# EAGLE design MBED LAOS Circuit Board (EAGLE 5.11)
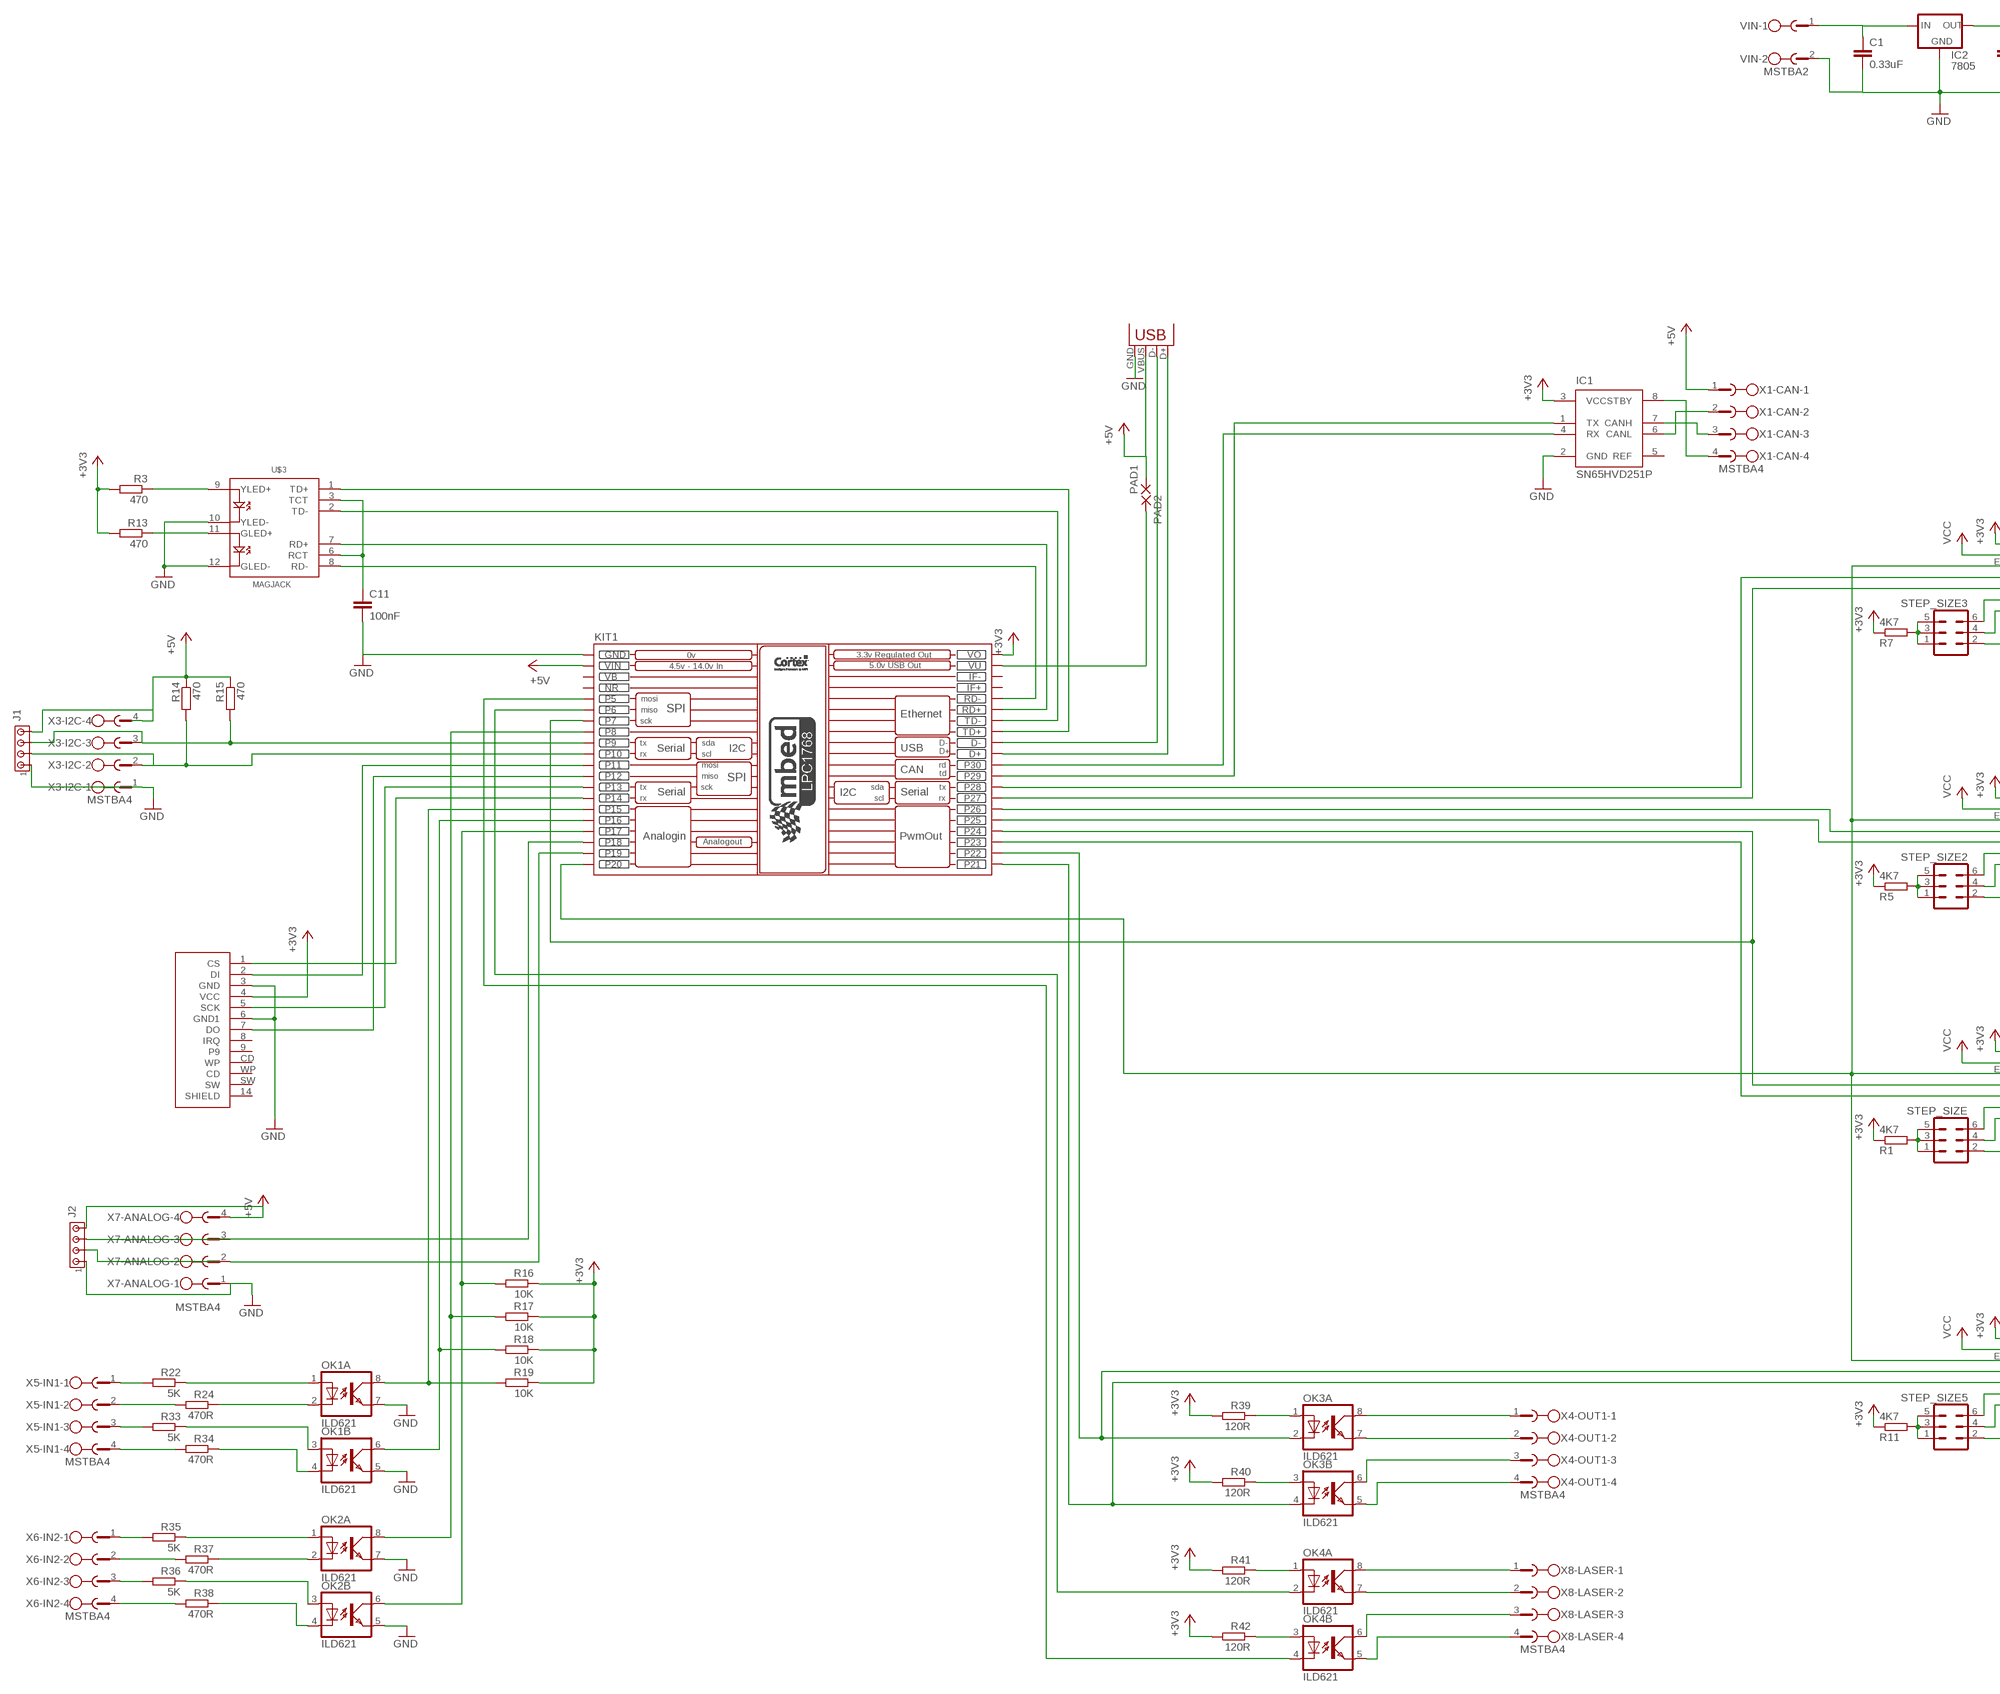
[diagram p0: schematic, sheet 1, part 1 of 2]
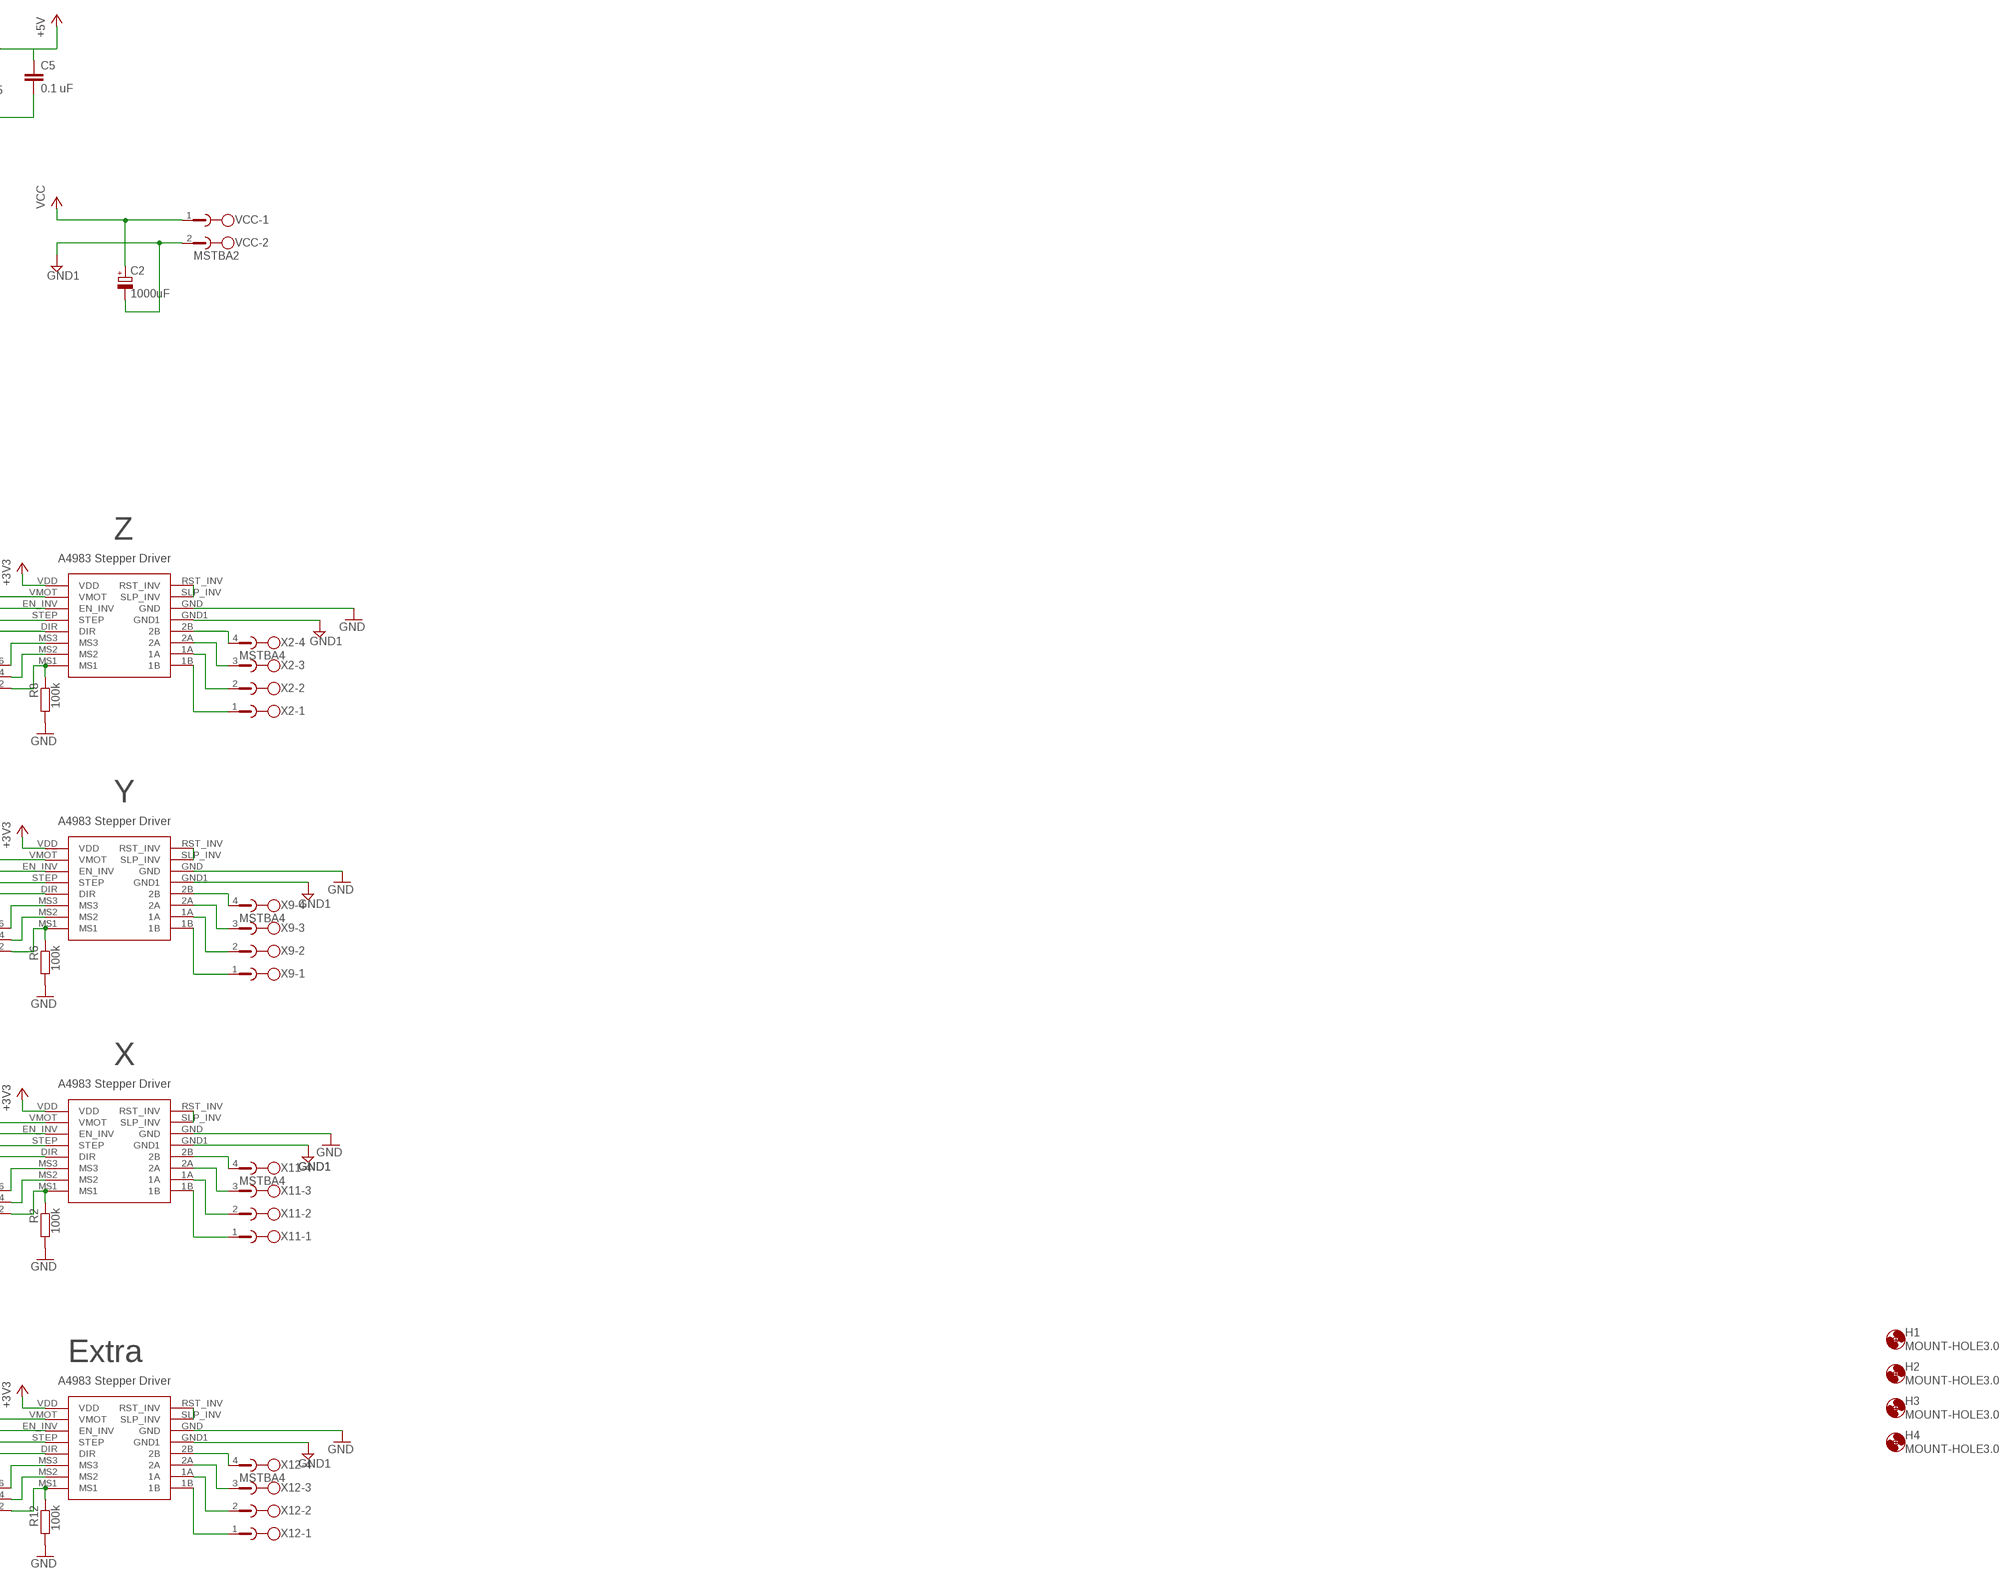
[diagram p1: schematic, sheet 1, part 2 of 2]

## Parts
C1  0.33uF  C-EU050-045X075  [C050-045X075]
C2  1000uF  CPOL-EUE7.5-16  [E7,5-16]
C5  0.1 uF  C-EU050-045X075  [C050-045X075]
C11  100nF  C-EU050-045X075  [C050-045X075]
EXTRA_STEPPER  A4983  [A4983]
H1  MOUNT-HOLE3.0  [3,0]
H2  MOUNT-HOLE3.0  [3,0]
H3  MOUNT-HOLE3.0  [3,0]
H4  MOUNT-HOLE3.0  [3,0]
IC1  SN65HVD251P  [DIL08]
IC2  7805  V_REG_78XXSIDE  [78XXL]
J1  MTA04-100  [10X04MTA]
J2  MTA04-100  [10X04MTA]
KIT1  MBED_NXP_LPC1768  [MBED-KIT]
OK1  ILD621  [DIL08]
OK2  ILD621  [DIL08]
OK3  ILD621  [DIL08]
OK4  ILD621  [DIL08]
PAD1  2,15/1,0  [2,15/1,0]
PAD2  2,15/1,0  [2,15/1,0]
R1  4K7  R-EU_0204/7  [0204/7]
R2  100k  R-EU_0204/7  [0204/7]
R3  470  R-EU_0204/7  [0204/7]
R5  4K7  R-EU_0204/7  [0204/7]
R6  100k  R-EU_0204/7  [0204/7]
R7  4K7  R-EU_0204/7  [0204/7]
R8  100k  R-EU_0204/7  [0204/7]
R11  4K7  R-EU_0204/7  [0204/7]
R12  100k  R-EU_0207/10  [0207/10]
R13  470  R-EU_0204/7  [0204/7]
R14  470  R-EU_0204/7  [0204/7]
R15  470  R-EU_0204/7  [0204/7]
R16  10K  R-EU_0204/7  [0204/7]
R17  10K  R-EU_0204/7  [0204/7]
R18  10K  R-EU_0204/7  [0204/7]
R19  10K  R-EU_0204/7  [0204/7]
R22  5K  R-EU_0204/7  [0204/7]
R24  470R  R-EU_0204/7  [0204/7]
R33  5K  R-EU_0204/7  [0204/7]
R34  470R  R-EU_0204/7  [0204/7]
R35  5K  R-EU_0204/7  [0204/7]
R36  5K  R-EU_0204/7  [0204/7]
R37  470R  R-EU_0204/7  [0204/7]
R38  470R  R-EU_0204/7  [0204/7]
R39  120R  R-EU_0204/7  [0204/7]
R40  120R  R-EU_0204/7  [0204/7]
R41  120R  R-EU_0204/7  [0204/7]
R42  120R  R-EU_0204/7  [0204/7]
STEP_SIZE  MA03-2  [MA03-2]
STEP_SIZE2  MA03-2  [MA03-2]
STEP_SIZE3  MA03-2  [MA03-2]
STEP_SIZE5  MA03-2  [MA03-2]
U$3  MAGJACK  [MAGJACK]
U$8  SD_CARD_SOCKETSD  [SD-MMC_SOCKET-PP]
VCC  MSTBA2  [MSTBA2]
VIN  MSTBA2  [MSTBA2]
X1-CAN  MSTBA4  [MSTBA4]
X2  MSTBA4  [MSTBA4]
X3-I2C  MSTBA4  [MSTBA4]
X4-OUT1  MSTBA4  [MSTBA4]
X5-IN1  MSTBA4  [MSTBA4]
X6-IN2  MSTBA4  [MSTBA4]
X7-ANALOG  MSTBA4  [MSTBA4]
X8-LASER  MSTBA4  [MSTBA4]
X9  MSTBA4  [MSTBA4]
X10  USB  [USB-MB-H-ASSMANN]
X11  MSTBA4  [MSTBA4]
X12  MSTBA4  [MSTBA4]
X_STEPPER  A4983  [A4983]
Y_STEPPER  A4983  [A4983]
Z_STEPPER  A4983  [A4983]

## Nets
+3V3: EXTRA_STEPPER.VDD IC1.3(VCC) KIT1.VOUT(VO) R1.1 R3.2 R5.1 R7.1 R11.1 R13.2 R16.1 R17.1 R18.1 R19.1 R39.2 R40.2 R41.2 R42.2 U$8.4(VCC) X_STEPPER.VDD Y_STEPPER.VDD Z_STEPPER.VDD
+5V: C5.1 IC2.OUT J1.4 J2.4 KIT1.VIN PAD1.1(P) R14.1 R15.1 X1-CAN.1 X3-I2C.4 X7-ANALOG.4 X10.VBUS
GND: C1.2 C5.2 C11.2 EXTRA_STEPPER.GND IC1.2(GND) IC2.GND J1.1 J2.1 KIT1.GND OK1.5(B:EMIT) OK1.7(A:EMIT) OK2.5(B:EMIT) OK2.7(A:EMIT) R2.2 R6.2 R8.2 R12.2 U$3.10(YLED-) U$3.12(GLED-) U$8.3(GND) U$8.6(GND1) VIN.2 X3-I2C.1 X7-ANALOG.1 X_STEPPER.GND Y_STEPPER.GND Z_STEPPER.GND
GND1: C2.- EXTRA_STEPPER.GND1 VCC.2 X_STEPPER.GND1 Y_STEPPER.GND1 Z_STEPPER.GND1
N$1: R2.1 STEP_SIZE.2 X_STEPPER.MS1
N$2: X_STEPPER.RST_INV X_STEPPER.SLP_INV
N$3: STEP_SIZE.4 X_STEPPER.MS2
N$4: R1.2 STEP_SIZE.1 STEP_SIZE.3 STEP_SIZE.5
N$5: STEP_SIZE.6 X_STEPPER.MS3
N$6: X11.4 X_STEPPER.2B
N$7: KIT1.P$23(P23) X_STEPPER.DIR
N$8: X11.3 X_STEPPER.2A
N$9: X11.2 X_STEPPER.1A
N$10: X11.1 X_STEPPER.1B
N$11: KIT1.P$7(P7) KIT1.P$24(P24) X_STEPPER.STEP
N$12: EXTRA_STEPPER.EN_INV KIT1.P$20(P20) X_STEPPER.EN_INV Y_STEPPER.EN_INV Z_STEPPER.EN_INV
N$13: KIT1.P$25(P25) Y_STEPPER.DIR
N$14: KIT1.P$26(P26) Y_STEPPER.STEP
N$15: KIT1.P$27(P27) Z_STEPPER.DIR
N$16: KIT1.P$28(P28) Z_STEPPER.STEP
N$17: IC1.1(TX) KIT1.P$29(P29)
N$18: IC1.4(RX) KIT1.P$30(P30)
N$19: R6.1 STEP_SIZE2.2 Y_STEPPER.MS1
N$20: R5.2 STEP_SIZE2.1 STEP_SIZE2.3 STEP_SIZE2.5
N$21: STEP_SIZE2.4 Y_STEPPER.MS2
N$22: STEP_SIZE2.6 Y_STEPPER.MS3
N$23: X9.3 Y_STEPPER.2A
N$24: X9.2 Y_STEPPER.1A
N$25: X9.1 Y_STEPPER.1B
N$26: IC1.8(STBY) X1-CAN.4
N$27: X9.4 Y_STEPPER.2B
N$28: Y_STEPPER.RST_INV Y_STEPPER.SLP_INV
N$29: R8.1 STEP_SIZE3.2 Z_STEPPER.MS1
N$30: R7.2 STEP_SIZE3.1 STEP_SIZE3.3 STEP_SIZE3.5
N$31: STEP_SIZE3.4 Z_STEPPER.MS2
N$32: STEP_SIZE3.6 Z_STEPPER.MS3
N$33: X2.3 Z_STEPPER.2A
N$34: X2.2 Z_STEPPER.1A
N$35: X2.1 Z_STEPPER.1B
N$36: X2.4 Z_STEPPER.2B
N$37: Z_STEPPER.RST_INV Z_STEPPER.SLP_INV
N$38: IC1.7(CANH) X1-CAN.3
N$39: IC1.6(CANL) X1-CAN.2
N$40: C1.1 IC2.IN VIN.1
N$41: KIT1.P$11(P11) U$8.2(DI)
N$43: KIT1.P$12(P12) U$8.7(DO)
N$44: KIT1.P$13(P13) U$8.5(SCK)
N$45: KIT1.P$14(P14) U$8.1(CS)
N$46: KIT1.D- X10.D-
N$47: EXTRA_STEPPER.MS1 R12.1 STEP_SIZE5.2
N$48: R11.2 STEP_SIZE5.1 STEP_SIZE5.3 STEP_SIZE5.5
N$49: EXTRA_STEPPER.MS2 STEP_SIZE5.4
N$50: EXTRA_STEPPER.MS3 STEP_SIZE5.6
N$51: EXTRA_STEPPER.2A X12.3
N$52: EXTRA_STEPPER.1A X12.2
N$53: EXTRA_STEPPER.1B X12.1
N$54: EXTRA_STEPPER.2B X12.4
N$55: EXTRA_STEPPER.RST_INV EXTRA_STEPPER.SLP_INV
N$56: KIT1.D+ X10.D+
N$58: J2.2
N$59: J2.3 KIT1.P$18(P18) X7-ANALOG.3
N$61: X10.GND
N$62: KIT1.VU PAD2.1(P)
N$69: R3.1 U$3.9(YLED+)
N$70: R13.1 U$3.11(GLED+)
N$71: KIT1.TD+ U$3.1(TD+)
N$81: KIT1.TD- U$3.2(TD-)
N$83: KIT1.RD+ U$3.7(RD+)
N$84: KIT1.RD- U$3.8(RD-)
N$85: C11.1 U$3.3(TCT) U$3.6(RCT)
N$86: KIT1.P$19(P19) X7-ANALOG.2
N$88: J1.2 KIT1.P$10(P10) R14.2 X3-I2C.2
N$92: J1.3 KIT1.P$9(P9) R15.2 X3-I2C.3
N$99: OK1.1(A:A) R22.1
N$101: OK1.2(A:C) R24.1
N$102: OK1.3(B:A) R33.1
N$103: OK1.4(B:C) R34.1
N$104: OK2.1(A:A) R35.1
N$105: OK2.2(A:C) R37.1
N$109: OK2.3(B:A) R36.1
N$110: OK2.4(B:C) R38.1
N$111: KIT1.P$15(P15) OK1.8(A:COL) R19.2
N$112: KIT1.P$16(P16) OK1.6(B:COL) R18.2
N$113: KIT1.P$8(P8) OK2.8(A:COL) R17.2
N$114: KIT1.P$17(P17) OK2.6(B:COL) R16.2
N$115: OK3.8(A:COL) X4-OUT1.1
N$116: OK3.7(A:EMIT) X4-OUT1.2
N$117: OK3.6(B:COL) X4-OUT1.3
N$118: OK3.5(B:EMIT) X4-OUT1.4
N$119: OK4.8(A:COL) X8-LASER.1
N$120: OK4.7(A:EMIT) X8-LASER.2
N$121: OK4.6(B:COL) X8-LASER.3
N$122: OK4.5(B:EMIT) X8-LASER.4
N$123: R22.2 X5-IN1.1
N$124: R24.2 X5-IN1.2
N$125: R33.2 X5-IN1.3
N$126: R34.2 X5-IN1.4
N$127: R35.2 X6-IN2.1
N$128: R36.2 X6-IN2.3
N$129: R37.2 X6-IN2.2
N$130: R38.2 X6-IN2.4
N$131: OK3.1(A:A) R39.1
N$132: OK3.3(B:A) R40.1
N$133: OK4.1(A:A) R41.1
N$134: OK4.3(B:A) R42.1
N$135: EXTRA_STEPPER.STEP KIT1.P$22(P22) OK3.2(A:C)
N$136: EXTRA_STEPPER.DIR KIT1.P$21(P21) OK3.4(B:C)
N$137: KIT1.P$6(P6) OK4.2(A:C)
N$138: KIT1.P$5(P5) OK4.4(B:C)
VCC: C2.+ EXTRA_STEPPER.VMOT VCC.1 X_STEPPER.VMOT Y_STEPPER.VMOT Z_STEPPER.VMOT
Unconnected: IC1.5(REF) KIT1.IF+ KIT1.IF- U$8.8(IRQ) U$8.9 U$8.14(SHIELD) U$8.CD(WP) U$8.SW U$8.WP(CD)

## Notes on the sheet
- Z
- Y
- X
- Extra

## Power pins joined to a net without a drawn wire
NR: KIT1.NR
VB: KIT1.VB

## Library data of the parts
C1 C5 = resistor:C-EU: CAPACITOR, European symbol
C2 = resistor:CPOL-EU: POLARIZED CAPACITOR, European symbol
C11 = rcl:C-EU: CAPACITOR, European symbol
EXTRA_STEPPER X_STEPPER Y_STEPPER Z_STEPPER = A4983(JJ):A4983
H1-H4 = holes:MOUNT-HOLE: MOUNTING HOLE with drill center marker
IC1 = ti-can:SN65HVD251
IC2 = SparkFun:V_REG_78XX: Voltage Regulator Standard 7805 5V regulator. IGO (Input Ground Output). Spark Fun Electronics SKU : COM-00107
J1 J2 = con-amp:MTA04-100: AMP connector; OC_FARNELL: unknown; OC_NEWARK: unknown
KIT1 = MBED_v2.1:MBED_NXP_LPC1768: Mbed LPC1768 - ARM CORTEX v2.1 * Schematic symbol is now placed in eagles's default raster. *The pads diameter are suitable for routing between mbed pins * mbed pads are 0.8 mm drill diameter. --------------------------------------------- Created by: Mohamed Yousry *Alexandria, Egypt *Email: mohamed.yousry@ieeegoldegypt.org
OK1-OK4 = optocoupler:ILD621: SIEMENS OPTO COUPLER; MF: VISHAY/TELEFUNKEN; MPN: ILD621; OC_FARNELL: 1020151; OC_NEWARK: 58K1678
PAD1 PAD2 = wirepad:2,15/1,0: THROUGH-HOLE PAD
R1 R3 R5-R7 R11-R19 R22 R24 R33-R42 = rcl:R-EU_: RESISTOR, European symbol
R2 R8 = resistor:R-EU_: RESISTOR, European symbol
STEP_SIZE STEP_SIZE2 STEP_SIZE3 STEP_SIZE5 = con-lstb:MA03-2: PIN HEADER; OC_FARNELL: unknown; OC_NEWARK: unknown
U$3 = SparkFun:MAGJACK
U$8 = SparkFun:SD_CARD_SOCKET: SD/MMC Socket Media socket for SD and MMC cards. Push-push type. Schematic element and footprint production proven. Spark Fun Electronics SKU : PRT-00136
VCC VIN = con-phoenix-508:MSTBA2: PHOENIX; MF: FARNELL; MPN: 1757242; OC_FARNELL: 3705171; OC_NEWARK: 71C4161
X1-CAN X2 X3-I2C X4-OUT1 X5-IN1 X6-IN2 X7-ANALOG X8-LASER X9 X11 X12 = con-phoenix-508:MSTBA4: PHOENIX; MF: FARNELL; MPN: 1757268; OC_FARNELL: 3705195; OC_NEWARK: 71C4163
X10 = SparkFun:USB: USB Connectors USB-B-PTH is fully proven SKU : PRT-00139 USB-miniB is fully proven SKU : PRT-00587 USB-A-PCB is untested. USB-A-H is throughly reviewed, but untested. Spark Fun Electronics SKU : PRT-00437 USB-B-SMT is throughly reviewed, but untested. Needs silkscreen touching up. USB-A-S has not been used/tested USB-MB-H has not been used/tested

## Net classes
0 default: width 0.254 mm, clearance 0.305 mm
1 signal: width 0.203 mm, clearance 0.406 mm
2 gnd: width 0.203 mm, drill 0.711 mm, clearance 0.305 mm
3 usbvcc: width 0.508 mm, drill 0.711 mm, clearance 0.305 mm

## Board
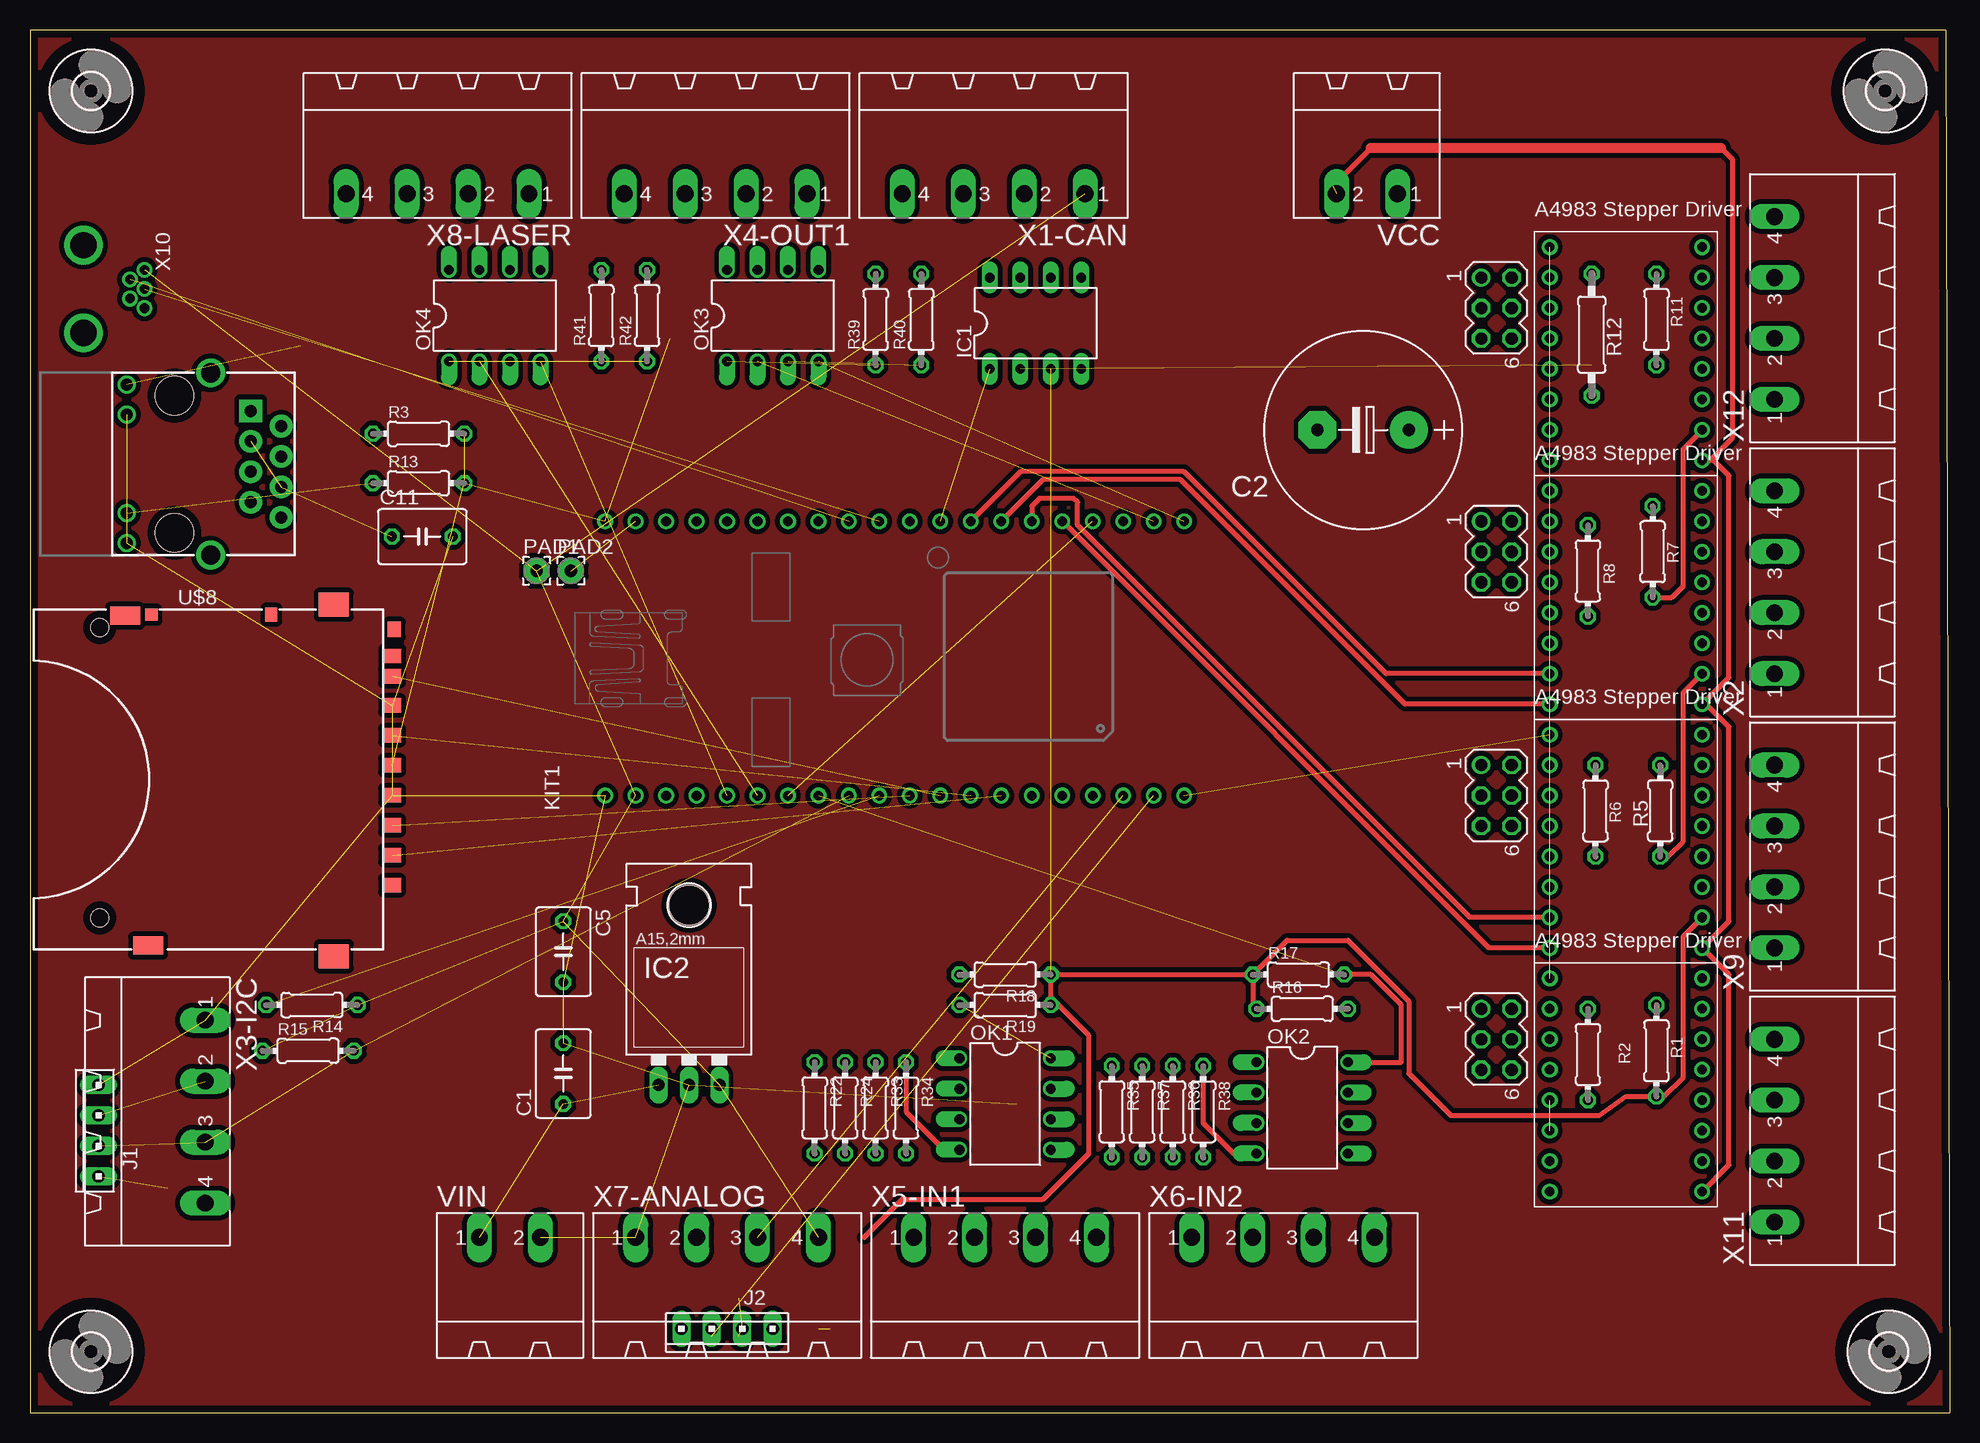
[diagram p2: board, top side]
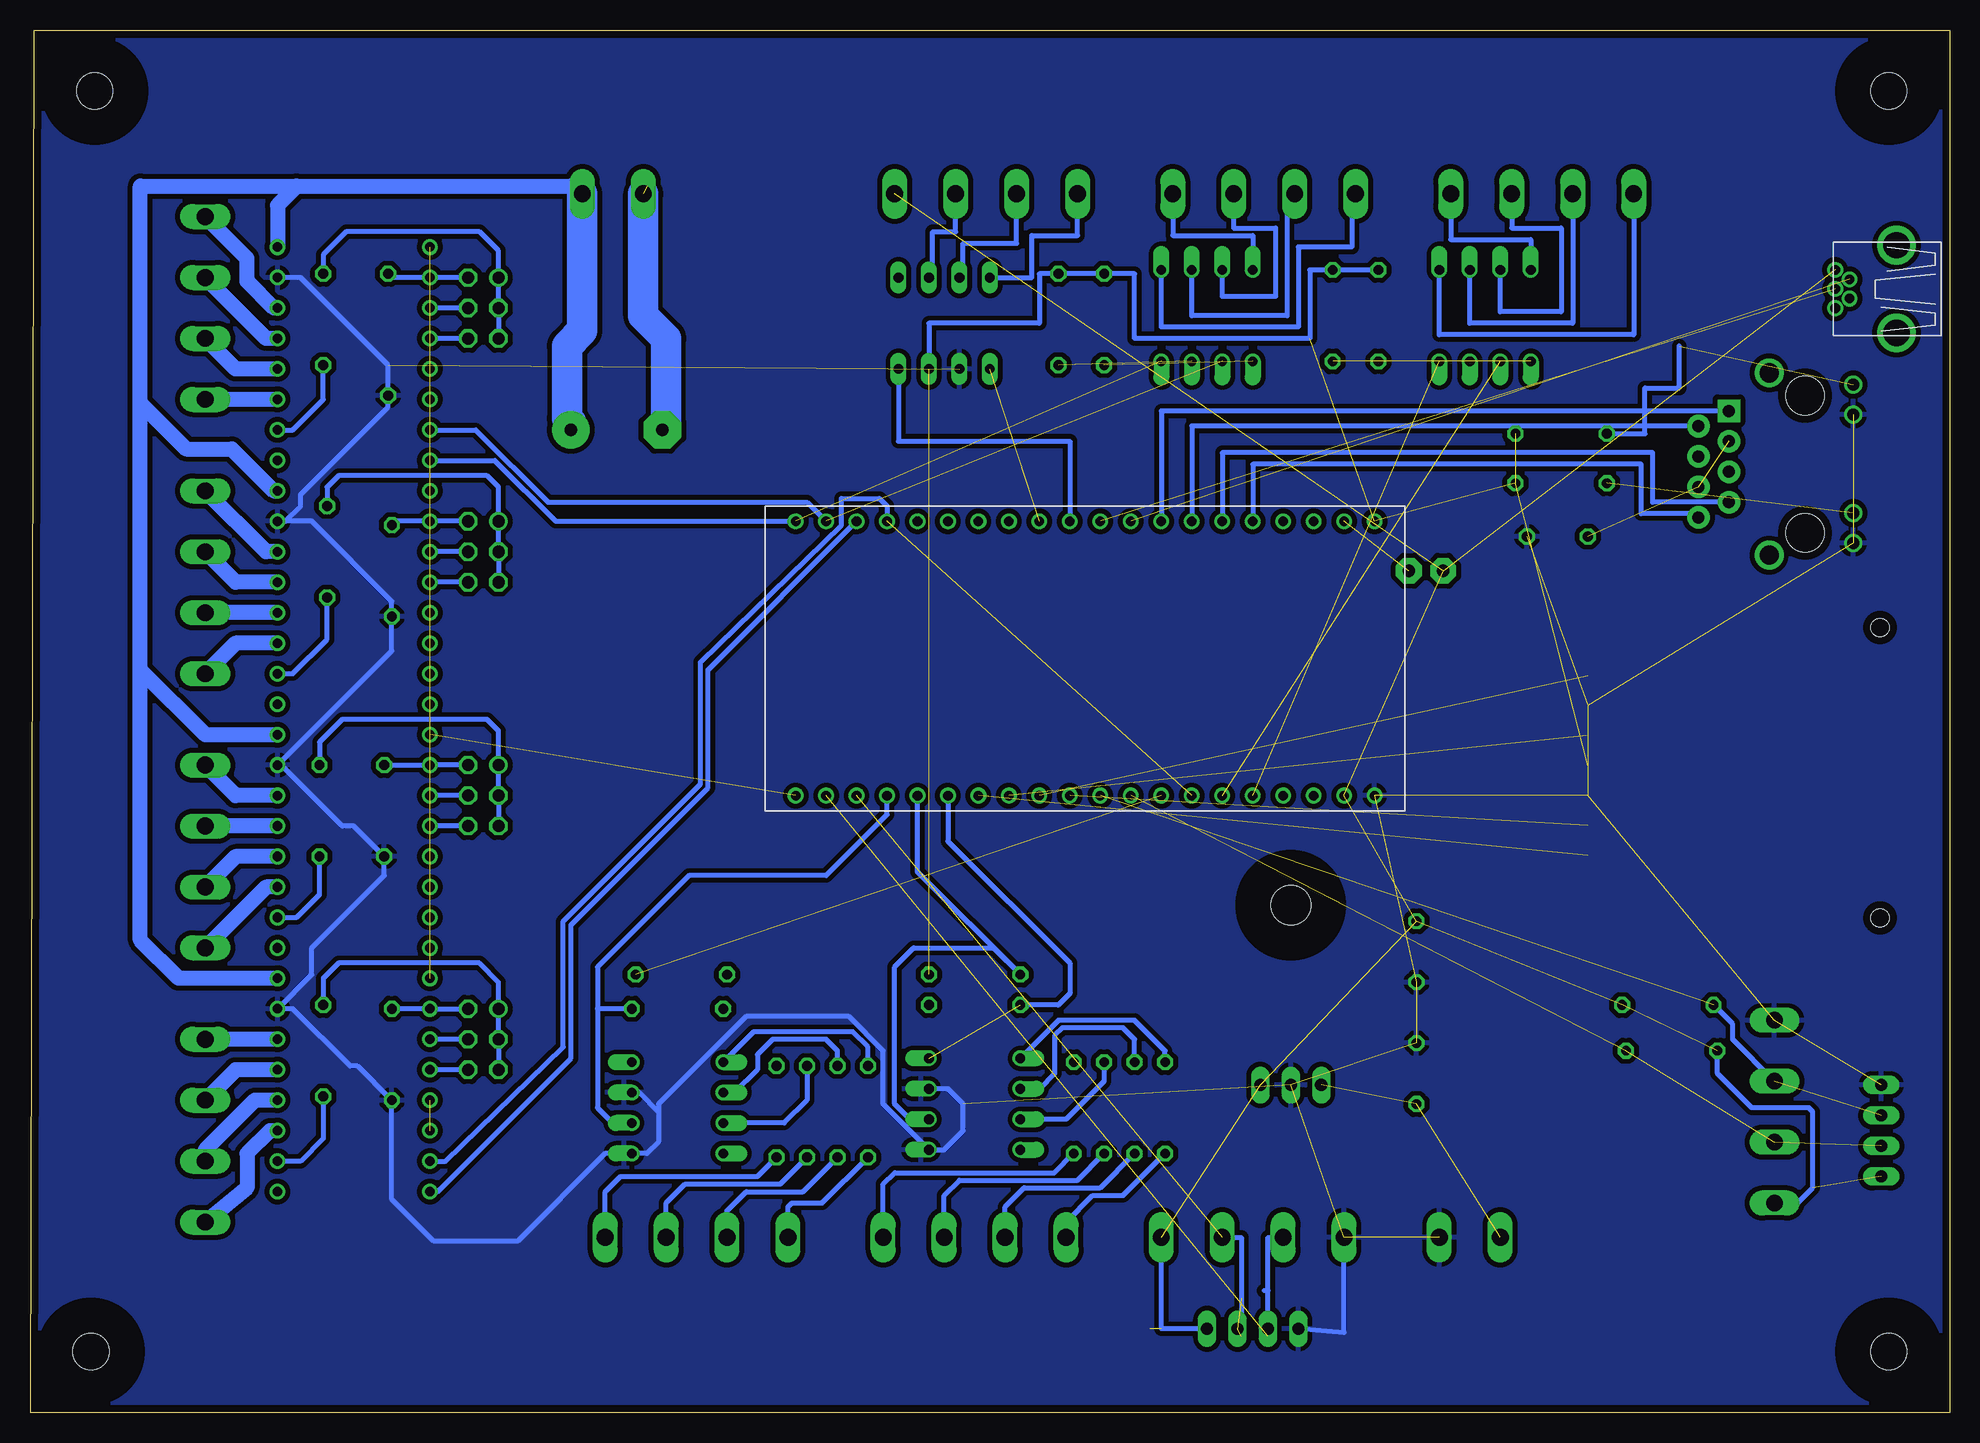
[diagram p3: board, bottom side, seen from below]

Size 160.02 x 115.25 mm. Coordinates in mm from the lower left corner, seen from the top.
Outline: 0,115.24 0,0 160.02,0 159.7,115.25 0,115.25
Copper layers (1*16): Top 0.035mm / dielectric 1.5mm / Bottom 0.035mm
Design rules "default *": minimum track width 8mil, minimum drill 20mil, track to track 0.2mm, track to pad 0.2mm, pad to pad 0.2mm, via to via 0.2mm, smd to smd 8mil, copper to edge 25mil, drill to drill 12mil, minimum pad ring 10mil, minimum via ring 8mil, stop-mask expansion 4mil, vias tented up to drill 0mil, thermal gap 15mil

### Footprints (pad centres in the part's own frame; a part is rotated, then mirrored left to right if it is on the bottom)
C050-045X075 = drill 0.813 octagon: 1 -2.54,0; 2 2.54,0
E7,5-16 = drill 1.016 pad 3.15 round: + -3.81,0 | drill 1.016 pad 3.15 octagon: - 3.81,0
A4983 = drill 0.8 round: 1A 6.35,-1.27; 1B 6.35,-3.81; 2A 6.35,1.27; 2B 6.35,3.81; DIR -6.35,-8.89; EN_INV -6.35,8.89; GND 6.35,6.35; GND1 6.35,-8.89; MS1 -6.35,6.35; MS2 -6.35,3.81; MS3 -6.35,1.27; RST_INV -6.35,-1.27; SLP_INV -6.35,-3.81; STEP -6.35,-6.35; VDD 6.35,-6.35; VMOT 6.35,8.89
3,0 = hole 3: 0,0
DIL08 = drill 0.813 long: 1 -3.81,-3.81; 2 -1.27,-3.81; 3 1.27,-3.81; 4 3.81,-3.81; 5 3.81,3.81; 6 1.27,3.81; 7 -1.27,3.81; 8 -3.81,3.81
78XXL = drill 1.016 long: GND 0,-3.81; IN -2.54,-3.81; OUT 2.54,-3.81 | hole 3.302: 0,11.176
10X04MTA = drill 1.016 long: 1 3.81,0; 2 1.27,0; 3 -1.27,0; 4 -3.81,0
MBED-KIT = drill 0.8 round: D+ 11.43,1.27; D- 11.43,3.81; GND -11.43,24.13; IF+ 11.43,16.51; IF- 11.43,19.05; NR -11.43,16.51; P$5 -11.43,13.97; P$6 -11.43,11.43; P$7 -11.43,8.89; P$8 -11.43,6.35; P$9 -11.43,3.81; P$10 -11.43,1.27; P$11 -11.43,-1.27; P$12 -11.43,-3.81; P$13 -11.43,-6.35; P$14 -11.43,-8.89; P$15 -11.43,-11.43; P$16 -11.43,-13.97; P$17 -11.43,-16.51; P$18 -11.43,-19.05; P$19 -11.43,-21.59; P$20 -11.43,-24.13; P$21 11.43,-24.13; P$22 11.43,-21.59; P$23 11.43,-19.05; P$24 11.43,-16.51; P$25 11.43,-13.97; P$26 11.43,-11.43; P$27 11.43,-8.89; P$28 11.43,-6.35; P$29 11.43,-3.81; P$30 11.43,-1.27; RD+ 11.43,11.43; RD- 11.43,13.97; TD+ 11.43,6.35; TD- 11.43,8.89; VB -11.43,19.05; VIN -11.43,21.59; VOUT 11.43,24.13; VU 11.43,21.59
DIL08' = drill 0.813 offset: 1 -3.81,-3.81; 2 -1.27,-3.81; 3 1.27,-3.81; 4 3.81,-3.81; 5 3.81,3.81; 6 1.27,3.81; 7 -1.27,3.81; 8 -3.81,3.81
2,15/1,0 = drill 1.016 pad 2.159 octagon: 1 0,0
0204/7 = drill 0.813 octagon: 1 -3.81,0; 2 3.81,0
0207/10 = drill 0.813 octagon: 1 -5.08,0; 2 5.08,0
MA03-2 = drill 1.016 round: 1 -2.54,-1.27 | drill 1.016 octagon: 2 -2.54,1.27; 3 0,-1.27; 4 0,1.27; 5 2.54,-1.27; 6 2.54,1.27
MAGJACK = drill 1 pad 1.88 square: 1 3.175,17.445 | drill 1 pad 1.88 round: 2 4.445,19.985; 3 5.715,17.445; 4 6.985,19.985; 5 8.255,17.445; 6 9.525,19.985; 7 10.795,17.445; 8 12.065,19.985 | drill 1 pad 1.27 round: 9 1,7.1; 10 3.5,7.1; 11 11.7,7.1; 12 14.2,7.1 | drill 1.6 pad 2.184 round: M1 0,14.1; M2 15.2,14.1 | hole 3.2: 1.905,11.095; 13.335,11.095
SD-MMC_SOCKET-PP = smd 1.2 x 1.5: 1 6.88,29.85; 2 4.38,29.85; 3 1.88,29.85; 4 -0.62,29.85; 5 -3.12,29.85; 6 -5.62,29.85; 7 -8.04,29.85; 8 -9.728,29.87; 9 9.38,29.85 | smd 1.5 x 2.5: 12 -13.1,7.6; 13 14.402,9.525 | smd 2 x 2.5: 14 -14,25; 15 15.3,25 | smd 1.15 x 1: CD -13.18,19.8 | smd 1.3 x 1.1: SW -11.938,30.048 | smd 1 x 1.05: WP -13.18,9.8 | hole 1.5: -12.1,5.5; 12.1,5.5
MSTBA2 = drill 1.397 long: 1 -2.54,5.08; 2 2.54,5.08
MSTBA4 = drill 1.397 long: 1 -7.62,5.08; 2 -2.54,5.08; 3 2.54,5.08; 4 7.62,5.08
USB-MB-H-ASSMANN = drill 0.8 round: D+ 5.1,0; D- 3.9,0.8; GND 5.1,-1.6; ID 3.9,-0.8; VBUS 5.1,1.6 | drill 2.2 round: P$6 0,-3.65; P$7 0,3.65

### Placement (x,y rotation side)
C1  44.45,28.26 90 top
C2  111.12,81.92 180 top
C5  44.45,38.42 270 top
C11  32.7,73.03 0 top
EXTRA_STEPPER  133.03,88.27 0 top
H1  5.08,5.08 0 top
H2  154.94,5.08 0 top
H3  154.62,110.17 0 top
H4  5.08,110.17 0 top
IC1  83.82,90.81 0 top
IC2  54.93,31.11 0 top
J1  5.71,23.5 90 top
J2  58.1,6.99 180 top
KIT1  72.07,62.87 90 top
OK1  ILD621  [DIL08']  81.28,25.72 270 top
OK2  ILD621  [DIL08']  106.05,25.4 270 top
OK3  ILD621  [DIL08']  61.91,91.44 0 top
OK4  ILD621  [DIL08']  38.73,91.44 0 top
PAD1  42.23,70.17 0 top
PAD2  45.09,70.17 0 top
R1  135.57,30.16 90 top
R2  129.86,29.84 270 top
R3  32.38,81.6 0 top
R5  135.89,50.16 90 top
R6  130.49,50.16 270 top
R7  135.25,71.75 90 top
R8  129.86,70.17 270 top
R11  135.57,91.12 90 top
R12  130.18,89.85 270 top
R13  32.38,77.47 0 top
R14  23.5,33.97 180 top
R15  23.18,30.16 0 top
R16  106.05,33.66 0 top
R17  105.73,36.51 0 top
R18  81.28,36.51 180 top
R19  81.28,33.97 180 top
R22  65.41,25.4 270 top
R24  67.94,25.4 270 top
R33  70.48,25.4 270 top
R34  73.03,25.4 270 top
R35  90.17,25.08 270 top
R36  95.25,25.08 270 top
R37  92.71,25.08 270 top
R38  97.79,25.08 270 top
R39  70.48,91.12 90 top
R40  74.3,91.12 90 top
R41  47.62,91.44 90 top
R42  51.44,91.44 90 top
STEP_SIZE  122.24,31.11 270 top
STEP_SIZE2  122.24,51.44 270 top
STEP_SIZE3  122.24,71.75 270 top
STEP_SIZE5  122.24,92.08 270 top
U$3  0.95,86.68 270 top
U$8  0.32,53.34 270 top
VCC  111.44,106.68 180 top
VIN  40.01,9.53 0 top
X1-CAN  80.33,106.68 180 top
X2  150.5,69.22 90 top
X3-I2C  9.53,25.08 270 top
X4-OUT1  57.15,106.68 180 top
X5-IN1  81.28,9.53 0 top
X6-IN2  104.46,9.53 0 top
X7-ANALOG  58.1,9.53 0 top
X8-LASER  33.97,106.68 180 top
X9  150.5,46.35 90 top
X10  4.45,93.66 0 top
X11  150.5,23.5 90 top
X12  150.5,92.08 90 top
X_STEPPER  133.03,27.3 0 top
Y_STEPPER  133.03,47.62 0 top
Z_STEPPER  133.03,67.94 0 top

### Tracks (layer width: path | path; a pad name or v marks a point on that pad's centre or on a via)
+3V3  (5 unrouted)
  Top 0.406: R17.1 R18.1 85.09,34.61 | 85.09,34.61 R19.1 | R17.1 101.92,33.97 R16.1 | Y_STEPPER.VDD 137.79,39.69 137.79,27.94 136.21,26.35 R1.1 133.03,26.35 130.81,24.77 118.43,24.77 114.94,28.26 114.94,34.29 109.86,39.37 104.78,39.37 R17.1 | R5.1 136.53,46.35 137.79,47.62 137.79,60.01 Z_STEPPER.VDD | R7.1 136.84,67.94 137.79,68.9 137.79,80.33 EXTRA_STEPPER.VDD | 69.53,14.61 72.71,17.78 84.45,17.78 88.27,21.59 88.27,31.43 85.09,34.61
  Bottom 0.406: IC1.3 85.09,90.81 75.88,90.81 75.88,94.93 R40.2 R39.2 67.94,94.93 67.94,89.53 53.34,89.53 53.34,95.25 R42.2 R41.2 | EXTRA_STEPPER.VDD 138.11,81.92 135.57,84.45 R11.1 | R7.1 135.25,64.45 138.11,61.59 Z_STEPPER.VDD | R5.1 135.89,43.18 137.79,41.27 Y_STEPPER.VDD | R1.1 135.57,22.86 137.48,20.95 X_STEPPER.VDD
+5V  (10 unrouted)
  Bottom 0.406: R15.1 19.37,28.26 16.51,25.4 11.75,25.4 11.43,25.08 11.43,18.73 13.02,17.14 14.29,17.14 X3-I2C.4 | J2.4 65.72,6.99 X7-ANALOG.4
GND  (14 unrouted)
  Bottom 0.406: 107.63,25.08 107.63,22.54 108.58,21.59 OK2.5 112.08,21.59 119.38,14.29 126.36,14.29 129.86,17.78 R2.2 132.72,28.89 133.35,28.89 138.11,33.66 X_STEPPER.GND 136.53,36.51 136.53,38.73 130.49,44.77 R6.2 133.03,48.9 133.99,48.9 139.06,53.98 Y_STEPPER.GND 129.86,63.5 R8.2 129.86,67.63 136.53,74.3 138.75,74.3 | 107.63,25.08 109.22,26.67 OK2.7 | OK1.7 83.5,26.99 82.23,25.72 82.23,23.5 83.82,21.91 OK1.5 88.9,25.72 88.9,30.16 91.76,33.02 100.33,33.02 107.63,25.72 107.63,25.08 | EXTRA_STEPPER.GND 137.48,94.61 130.18,87.31 R12.2 130.18,83.82 137.48,76.52 137.48,75.56 138.75,74.3 | 138.75,74.3 Z_STEPPER.GND | X7-ANALOG.1 50.48,6.67 J2.1
  pour Bottom (isolate 0.406): 0,115.25 159.7,115.25 160.02,0 0,0
GND1  (1 unrouted)
  Top 0.406: X_STEPPER.GND1 141.6,20.64 141.6,36.51 Y_STEPPER.GND1 141.6,40.96 141.6,57.15 139.7,59.05 Z_STEPPER.GND1 141.6,61.28 141.6,78.11 140.34,79.38 EXTRA_STEPPER.GND1 140.02,79.38 141.92,81.28 141.92,104.46 140.97,105.41 | 111.76,105.41 108.58,102.23
  Top 0.813: 140.97,105.41 111.76,105.41
  Bottom 2.54: VCC.2 108.9,91.44 107,89.53 107,82.23 C2.-
N$1
  Bottom 0.406: R2.1 X_STEPPER.MS1 STEP_SIZE.2
N$2  (1 unrouted)
N$3
  Bottom 0.406: STEP_SIZE.4 X_STEPPER.MS2
N$4
  Bottom 0.406: R1.2 135.57,36.2 134.3,37.47 122.56,37.47 120.97,35.88 STEP_SIZE.1 STEP_SIZE.3 STEP_SIZE.5
N$5
  Bottom 0.406: STEP_SIZE.6 X_STEPPER.MS3
N$6
  Bottom 1.27: X_STEPPER.2B X11.4
N$7
  Bottom 0.406: X_STEPPER.DIR 126.05,18.41 114.94,29.53 114.94,40.64 103.5,52.07 103.5,61.91 KIT1.P$23
N$8
  Bottom 1.27: X_STEPPER.2A 142.88,28.57 X11.3
N$9
  Bottom 1.27: X_STEPPER.1A 141.29,26.04 145.41,21.91 X11.2
N$10
  Bottom 1.27: X_STEPPER.1B 140.02,23.5 141.92,21.59 141.92,18.73 X11.1
N$11  (1 unrouted)
  Bottom 0.406: X_STEPPER.STEP 125.41,20.95 115.57,30.48 115.57,40.96 104.14,52.39 104.14,62.55 92.39,73.98 92.39,76.2 89.22,76.2 88.58,75.56 KIT1.P$24
N$12  (4 unrouted)
N$13
  Top 0.406: Y_STEPPER.DIR 121.6,38.73 KIT1.P$25
N$14
  Top 0.406: Y_STEPPER.STEP 120.02,41.27 87.31,73.98 87.31,75.88 87,76.2 84.14,76.2 83.5,75.56 KIT1.P$26
N$15
  Top 0.406: Z_STEPPER.DIR 114.62,59.05 95.89,77.79 84.45,77.79 KIT1.P$27
N$16
  Top 0.406: Z_STEPPER.STEP 113.03,61.59 96.2,78.42 82.55,78.42 KIT1.P$28
N$17  (1 unrouted)
N$18
  Bottom 0.406: IC1.4 87.63,80.96 73.34,80.96 KIT1.P$30
N$19
  Bottom 0.406: STEP_SIZE2.2 Y_STEPPER.MS1 R6.1
N$20
  Bottom 0.406: R5.2 135.89,55.88 133.99,57.78 121.92,57.78 120.97,56.83 STEP_SIZE2.1 STEP_SIZE2.3 STEP_SIZE2.5
N$21
  Bottom 0.406: STEP_SIZE2.4 Y_STEPPER.MS2
N$22
  Bottom 0.406: STEP_SIZE2.6 Y_STEPPER.MS3
N$23
  Bottom 1.27: Y_STEPPER.2A X9.3
N$24
  Bottom 1.27: Y_STEPPER.1A 142.88,46.35 X9.2
N$25
  Bottom 1.27: Y_STEPPER.1B 140.34,43.81 X9.1
N$26
  Bottom 0.406: IC1.8 76.52,94.61 76.52,98.11 72.71,98.11 X1-CAN.4
N$27
  Bottom 1.27: Y_STEPPER.2B 142.88,51.44 X9.4
N$28  (1 unrouted)
N$29
  Bottom 0.406: STEP_SIZE3.2 Z_STEPPER.MS1 129.54,74.3 R8.1
N$30
  Bottom 0.406: R7.2 135.25,77.15 134.3,78.11 121.92,78.11 120.97,77.15 STEP_SIZE3.1 STEP_SIZE3.3 STEP_SIZE3.5
N$31
  Bottom 0.406: STEP_SIZE3.4 Z_STEPPER.MS2
N$32
  Bottom 0.406: STEP_SIZE3.6 Z_STEPPER.MS3
N$33
  Bottom 1.27: Z_STEPPER.2A 142.88,69.22 X2.3
N$34
  Bottom 1.27: Z_STEPPER.1A X2.2
N$35
  Bottom 1.27: Z_STEPPER.1B 142.88,64.14 X2.1
N$36
  Bottom 1.27: Z_STEPPER.2B 140.34,71.75 X2.4
N$37  (1 unrouted)
N$38
  Bottom 0.406: IC1.7 82.23,94.61 82.23,97.47 77.79,97.47 X1-CAN.3
N$39
  Bottom 0.406: IC1.6 84.77,94.61 84.77,98.42 82.87,98.42 X1-CAN.2
N$40  (2 unrouted)
N$41  (1 unrouted)
N$43  (1 unrouted)
N$44  (1 unrouted)
N$45  (1 unrouted)
N$46  (1 unrouted)
N$47
  Bottom 0.406: STEP_SIZE5.2 EXTRA_STEPPER.MS1 129.86,94.61 R12.1
N$48
  Bottom 0.406: R11.2 135.57,96.52 133.67,98.42 122.56,98.42 120.97,96.84 STEP_SIZE5.1 STEP_SIZE5.3 STEP_SIZE5.5
N$49
  Bottom 0.406: STEP_SIZE5.4 EXTRA_STEPPER.MS2
N$50
  Bottom 0.406: STEP_SIZE5.6 EXTRA_STEPPER.MS3
N$51
  Bottom 1.27: EXTRA_STEPPER.2A 140.34,89.53 X12.3
N$52
  Bottom 1.27: EXTRA_STEPPER.1A 142.88,87 X12.2
N$53
  Bottom 1.27: EXTRA_STEPPER.1B X12.1
N$54
  Bottom 1.27: EXTRA_STEPPER.2B 139.7,92.08 141.92,94.3 141.92,96.2 X12.4
N$55  (1 unrouted)
N$56  (1 unrouted)
N$59  (3 unrouted)
  Bottom 0.406: X7-ANALOG.3 59.05,14.61 59.05,6.35
N$62  (1 unrouted)
N$69  (1 unrouted)
  Bottom 0.406: R3.1 25.4,81.6 25.4,85.41 22.54,85.41 22.54,88.9
N$70  (1 unrouted)
N$71
  Bottom 0.406: U$3.1 65.72,83.5 KIT1.TD+
N$81
  Bottom 0.406: U$3.2 63.18,82.23 KIT1.TD-
N$83
  Bottom 0.406: U$3.7 24.77,75.88 24.77,80.01 60.64,80.01 KIT1.RD+
N$84
  Bottom 0.406: U$3.8 21.27,74.61 21.27,74.93 25.72,74.93 25.72,79.06 58.1,79.06 KIT1.RD-
N$85  (2 unrouted)
N$86  (1 unrouted)
  Bottom 0.406: X7-ANALOG.2 56.83,14.61 56.83,10.16 | 56.83,10.16 57.15,10.16 | 56.83,6.35 56.83,10.16
N$88  (2 unrouted)
  Bottom 0.406: R14.2 18.1,32.38 18.1,31.11 X3-I2C.2
N$92  (3 unrouted)
N$99
  Bottom 0.406: R22.1 65.41,30.16 67.94,32.7 74.3,32.7 OK1.1
N$101
  Bottom 0.406: R24.1 67.94,31.11 68.9,32.07 73.98,32.07 74.61,31.43 74.61,28.26 75.88,26.99 OK1.2
N$102
  Bottom 0.406: R33.1 70.48,27.62 73.66,24.45 OK1.3
N$103
  Top 0.406: R34.1 73.03,25.08 76.2,21.91 OK1.4
N$104
  Bottom 0.406: R35.1 90.17,30.48 91.44,31.75 99.69,31.75 OK2.1
N$105
  Bottom 0.406: R37.1 92.71,30.16 93.66,31.11 98.11,31.11 99.38,29.84 99.38,28.57 101.28,26.67 OK2.2
N$109
  Bottom 0.406: R36.1 95.25,26.04 97.16,24.13 OK2.3
N$110
  Top 0.406: R38.1 97.79,24.13 100.33,21.59 OK2.4
N$111  (1 unrouted)
  Bottom 0.406: KIT1.P$15 83.5,47.62 73.34,37.47 73.34,34.92 74.3,33.97 R19.2
N$112
  Bottom 0.406: KIT1.P$16 86.04,45.09 R18.2 79.69,38.73 86.36,38.73 87.95,37.15 87.95,25.72 86.68,24.45 OK1.6
N$113  (1 unrouted)
  Top 0.406: R17.2 111.76,36.51 114.3,33.97 114.3,29.21 OK2.8
N$114
  Bottom 0.406: KIT1.P$17 88.58,49.85 93.66,44.77 105.09,44.77 112.71,37.15 112.71,33.66 | R16.2 112.71,33.66 | 112.71,33.66 112.71,25.4 111.44,24.13 OK2.6
N$115
  Bottom 0.406: X4-OUT1.1 64.77,98.11 58.1,98.11 OK3.8
N$116
  Bottom 0.406: X4-OUT1.2 59.69,98.74 56.2,98.74 56.2,93.03 60.64,93.03 OK3.7
N$117
  Bottom 0.406: X4-OUT1.3 55.24,101.6 55.24,91.44 63.18,91.44 OK3.6
N$118
  Bottom 0.406: X4-OUT1.4 49.85,101.6 49.85,97.16 54.29,97.16 54.29,90.49 65.72,90.49 OK3.5
N$119
  Bottom 0.406: X8-LASER.1 41.59,97.79 34.92,97.79 OK4.8
N$120
  Bottom 0.406: X8-LASER.2 36.51,98.74 32.38,98.74 32.38,91.76 37.47,91.76 OK4.7
N$121
  Bottom 0.406: X8-LASER.3 31.43,90.81 40.01,90.81 OK4.6
N$122
  Bottom 0.406: X8-LASER.4 26.35,89.85 42.55,89.85 OK4.5
N$123
  Bottom 0.406: X5-IN1.1 73.66,15.88 71.44,18.1 68.9,18.1 R22.2
N$124
  Bottom 0.406: X5-IN1.2 78.74,17.14 77.15,18.73 70.8,18.73 R24.2
N$125
  Bottom 0.406: X5-IN1.3 83.82,18.1 82.55,19.37 72.71,19.37 R33.2
N$126
  Bottom 0.406: X5-IN1.4 88.9,19.05 87.95,20 74.61,20 R34.2
N$127
  Bottom 0.406: X6-IN2.1 96.84,17.14 96.52,17.46 93.98,17.46 R35.2
N$128
  Bottom 0.406: X6-IN2.3 107,17.46 105.41,19.05 97.47,19.05 R36.2
N$129
  Bottom 0.406: X6-IN2.2 101.92,16.83 100.33,18.41 95.57,18.41 R37.2
N$130
  Bottom 0.406: X6-IN2.4 112.08,18.41 110.81,19.68 99.38,19.68 R38.2
N$131  (1 unrouted)
N$132  (1 unrouted)
N$133  (1 unrouted)
N$134  (1 unrouted)
N$135  (1 unrouted)
  Bottom 0.406: EXTRA_STEPPER.STEP 122.87,81.92 116.84,75.88 95.25,75.88 KIT1.P$22
N$136  (1 unrouted)
  Bottom 0.406: EXTRA_STEPPER.DIR 121.28,79.38 116.2,74.3 KIT1.P$21
N$137  (1 unrouted)
N$138  (1 unrouted)
VCC
  Bottom 1.27: EXTRA_STEPPER.VMOT 139.38,100.65 137.79,102.23 | Z_STEPPER.VMOT 139.7,76.83 143.19,80.33 147,80.33 150.81,84.14 | 150.81,84.14 150.81,102.23 137.79,102.23 | 137.79,102.23 114.94,102.23 114.3,101.6 VCC.1 | Y_STEPPER.VMOT 145.41,56.52 150.81,61.91 | X_STEPPER.VMOT 147.64,36.2 150.81,39.37 150.81,61.91 | 150.81,61.91 150.81,84.14
  Bottom 2.54: VCC.1 113.98,90.17 115.25,88.9 115.25,82.87 114.94,82.55 C2.+
VCC/2
  pour Top (isolate 0.406): 0,115.25 159.7,115.25 160.02,0 0,0

### Text on the board
tNames: HEATED BED | HEATER 2 | HEATER 1 | POWER 16-20 VDC